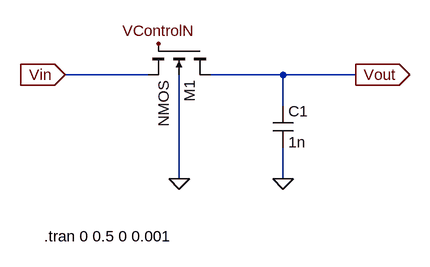
[diagram p0: schematic Lab 6 Part 2a.asc]
Lab 6 Part 2a.asc, the LTspice schematic file:
Version 4
SHEET 1 880 680
WIRE 32 208 -96 208
WIRE 240 208 128 208
WIRE 352 208 240 208
WIRE 240 256 240 208
WIRE 80 368 80 208
WIRE 240 368 240 320
FLAG -96 208 Vin
IOPIN -96 208 In
FLAG 352 208 Vout
IOPIN 352 208 Out
FLAG 240 368 0
FLAG 48 160 VControlN
FLAG 80 368 0
SYMBOL nmos4 128 160 R90
SYMATTR InstName M1
SYMBOL cap 224 256 R0
SYMATTR InstName C1
SYMATTR Value 1n
TEXT -128 456 Left 2 !.tran 0 0.5 0 0.001

The netlist it stands for:
* Lab 6 Part 2a.asc
M1 Vout VControlN Vin 0 NMOS
C1 Vout 0 1n
.model NMOS NMOS
.model PMOS PMOS
.lib standard.mos
.tran 0 0.5 0 0.001
.backanno
.end